# Altium schematic sheet Buck.SchDoc
size A4; SheetNumber: 1; SheetTotal: 1
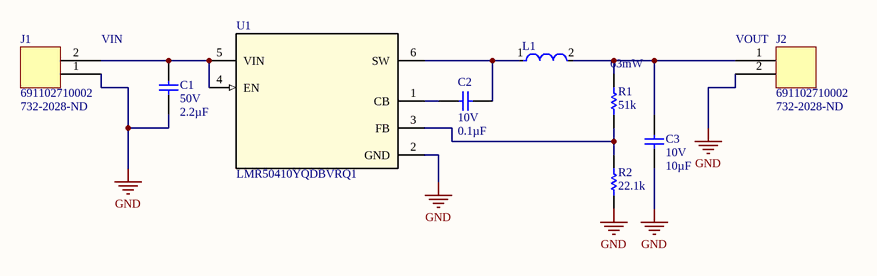
[diagram p0: Buck.SchDoc]

## Parts
C1  value 2.2µF  Voltage - Rated: 50V  [CAP1210R]  (hidden comment: CGA6M3X7R1H225M200AB)
C2  value 0.1µF  Voltage - Rated: 10V  [CAP0603R]  (hidden comment: LMK107BBJ106MAHT)
C3  value 10µF  Voltage - Rated: 10V  [CAP0805R]  (hidden comment: GCM21BR71A106KE22L)
J1  691102710002  Supplier Part Number 1: 732-2028-ND  [CON2_SCREW_5.00MM_691102710002]
J2  691102710002  Supplier Part Number 1: 732-2028-ND  [CON2_SCREW_5.00MM_691102710002]
L1  DFE322520FD-3R3M=P2  [FP-DFE322520F_D-IPC_B]  (value not drawn)
R1  value 51k  Power: 63mW  [RES0603R]  (hidden comment: Resistor 51k +/-5% 0402 63 mW)
R2  value 22.1k  [RES0603R]  (hidden comment: CRCW060322K1FKEA)
U1  LMR50410YQDBVRQ1  [DBV0006A-IPC_A]

## Nets
GND: C1.1 C3.1 J1.1 J2.2 R2.1 U1.2(GND)
NetC1_2: C1.2 J1.2 U1.4(EN) U1.5(VIN)
NetC2_1: C2.1 L1.1 U1.6(SW)
NetC2_2: C2.2 U1.1(CB)
NetC3_2: C3.2 J2.1 L1.2 R1.2
NetR1_1: R1.1 R2.2 U1.3(FB)

## Notes on the sheet
- VIN
- (near J2) VOUT

## Library data of the parts
C1 = CMP-024-000534-5: CAP CER 2.2UF 50V X7R 1210; Manufacturer: TDK Corporation; Tolerance: ±20%; Case/Package: 1210 (3225 Metric); Max Operating Temperature: 125°C; Temperature Coefficient: X7R; ComponentLink1Description: Datasheet; ComponentLink1URL: https://product.tdk.com/info/en/catalog/datasheets/mlcc_automotive_general_en.pdf?ref_disty=digikey; Min Operating Temperature: -55°C; Supplier Part Number 1: 445-13028-1-ND; Supplier 1: Digi-Key; PN: CGA6M3X7R1H225M200AB; Ratings: AEC-Q200
C2 = CMP-024-001218-5: CAP CER 10UF 10V X5R 0603; Manufacturer: Taiyo Yuden; Tolerance: ±20%; Temperature Coefficient: X5R; Ratings: AEC-Q200; Supplier Part Number 1: 587-3412-2-ND; Min Operating Temperature: -55°C; PN: LMK107BBJ106MAHT; ComponentLink1URL: https://ds.yuden.co.jp/TYCOMPAS/ut/detail?pn=LMK107BBJ106MAHT%20%20&u=M; Supplier 1: Digi-Key; Case/Package: 0603 (1608 Metric); Max Operating Temperature: 85°C; ComponentLink1Description: Datasheet
C3 = CMP-024-000714-5: CAP CER 10UF 10V X7R 0805; Manufacturer: Murata Electronics; Tolerance: ±10%; Min Operating Temperature: -55°C; Max Operating Temperature: 125°C; Supplier 1: Digi-Key; Case/Package: 0805 (2012 Metric); PN: GCM21BR71A106KE22L; Supplier Part Number 1: 490-10674-1-ND; Temperature Coefficient: X7R; ComponentLink1Description: Datasheet; ComponentLink1URL: https://search.murata.co.jp/Ceramy/image/img/A01X/G101/ENG/GCM21BR71A106KE22-01.pdf; Ratings: AEC-Q200
J1 J2 = CMP-027-000000-1: 2 Position Wire to Board Terminal Block Horizontal with Board 0.197" (5.00mm) Through Hole; Manufacturer: Würth Elektronik; Connector Type: Screw Terminal; Number of Positions: 2; Pitch - Mating: 0.197" (5.00mm); ComponentLink1URL: https://www.we-online.de/katalog/datasheet/6911027100xx.pdf; ComponentLink1Description: Datasheet; Supplier 1: Digi-Key; Series: WR-TBL Series 102; PN: 691102710002; Number of Rows: 1; Contact Type: Wire
L1 = CMP-006-00002-2: FIXED IND 3.3UH 2.3A 65 MOHM SMD; ComponentLink1Description: Digi-Key; ComponentLink1URL: https://www.digikey.ca/en/products/detail/murata-electronics/DFE322520FD-3R3M-P2/10135197
R1 = CMP-054-001030-4: Chip Resistor, 51 KOhm, +/- 5%, 0.063 W, -55 to 155 degC, 0402 (1005 Metric); Manufacturer: Vishay Dale; PN: CRCW060322K1FKEA; Tolerance: ±1%; ComponentLink1Description: Datasheet; Package: 0603 (1608 Metric); Supplier 1: Digi-Key; Min Operating Temperature: -55°C; ComponentLink1URL: https://www.vishay.com/docs/20035/dcrcwe3.pdf; Max Operating Temperature: 155°C; Composition: Thick Film; Ratings: AEC-Q200; Supplier Part Number 1: 541-22.1KHCT-ND
R2 = CMP-054-001030-4: RES SMD 22.1K OHM 1% 1/10W 0603; Manufacturer: Vishay Dale; Power: 0.1W, 1/10W; ComponentLink1Description: Datasheet; Package: 0603 (1608 Metric); Supplier 1: Digi-Key; Min Operating Temperature: -55°C; ComponentLink1URL: https://www.vishay.com/docs/20035/dcrcwe3.pdf; PN: CRCW060322K1FKEA; Max Operating Temperature: 155°C; Composition: Thick Film; Ratings: AEC-Q200; Supplier Part Number 1: 541-22.1KHCT-ND; Tolerance: ±1%
U1 = LMR50410YQDBVRQ1: No Description Available; Mfr_Name: Texas Instruments; TYPE: TYPE; RefDes: RefDes